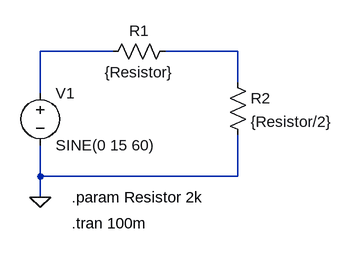
[diagram p0: schematic Param Divisor Resistivo.asc]
Param Divisor Resistivo.asc, the LTspice schematic file:
Version 4
SHEET 1 880 680
WIRE 144 32 32 32
WIRE 336 32 224 32
WIRE 336 80 336 32
WIRE 32 96 32 32
WIRE 32 224 32 176
WIRE 336 224 336 160
WIRE 336 224 32 224
WIRE 32 256 32 224
FLAG 32 256 0
SYMBOL voltage 32 80 R0
WINDOW 123 0 0 Left 0
WINDOW 39 0 0 Left 0
SYMATTR InstName V1
SYMATTR Value SINE(0 15 60)
SYMBOL res 240 16 R90
WINDOW 0 0 56 VBottom 2
WINDOW 3 32 56 VTop 2
SYMATTR InstName R1
SYMATTR Value {Resistor}
SYMBOL res 320 64 R0
SYMATTR InstName R2
SYMATTR Value {Resistor/2}
TEXT 80 256 Left 2 !.param Resistor 2k
TEXT 80 296 Left 2 !.tran 100m

The netlist it stands for:
* Param Divisor Resistivo.asc
V1 N001 0 SINE(0 15 60)
R1 N002 N001 {Resistor}
R2 N002 0 {Resistor/2}
.param Resistor 2k
.tran 100m
.backanno
.end